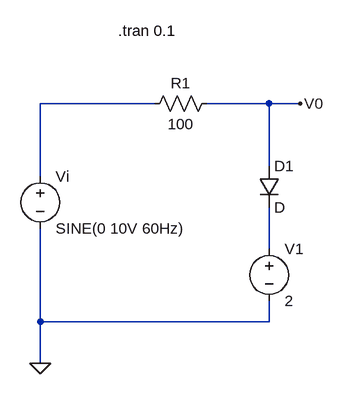
[diagram p0: schematic Diode_Clipper_With_Bias.asc]
Diode_Clipper_With_Bias.asc, the LTspice schematic file:
Version 4.1
SHEET 1 880 680
WIRE 160 176 -16 176
WIRE 336 176 240 176
WIRE 384 176 336 176
WIRE 336 272 336 176
WIRE -16 288 -16 176
WIRE 336 400 336 336
WIRE -16 512 -16 368
WIRE 336 512 336 480
WIRE 336 512 -16 512
WIRE -16 576 -16 512
FLAG 384 176 V0
FLAG -16 576 0
SYMBOL res 256 160 R90
WINDOW 0 0 56 VBottom 2
WINDOW 3 32 56 VTop 2
SYMATTR InstName R1
SYMATTR Value 100
SYMBOL voltage -16 272 R0
WINDOW 123 0 0 Left 0
WINDOW 39 0 0 Left 0
SYMATTR InstName Vi
SYMATTR Value SINE(0 10V 60Hz)
SYMBOL diode 320 272 R0
SYMATTR InstName D1
SYMBOL voltage 336 384 R0
WINDOW 123 0 0 Left 0
WINDOW 39 0 0 Left 0
SYMATTR InstName V1
SYMATTR Value 2
TEXT 104 64 Left 2 !.tran 0.1

The netlist it stands for:
* Diode_Clipper_With_Bias.asc
R1 V0 N001 100
Vi N001 0 SINE(0 10V 60Hz)
D1 V0 N002 D
V1 N002 0 2
.model D D
.lib standard.dio
.tran 0.1
.backanno
.end